# Altium schematic sheet CH592F-3MODE-MS-T0-1v2.SchDoc
size 350 x 330 mm
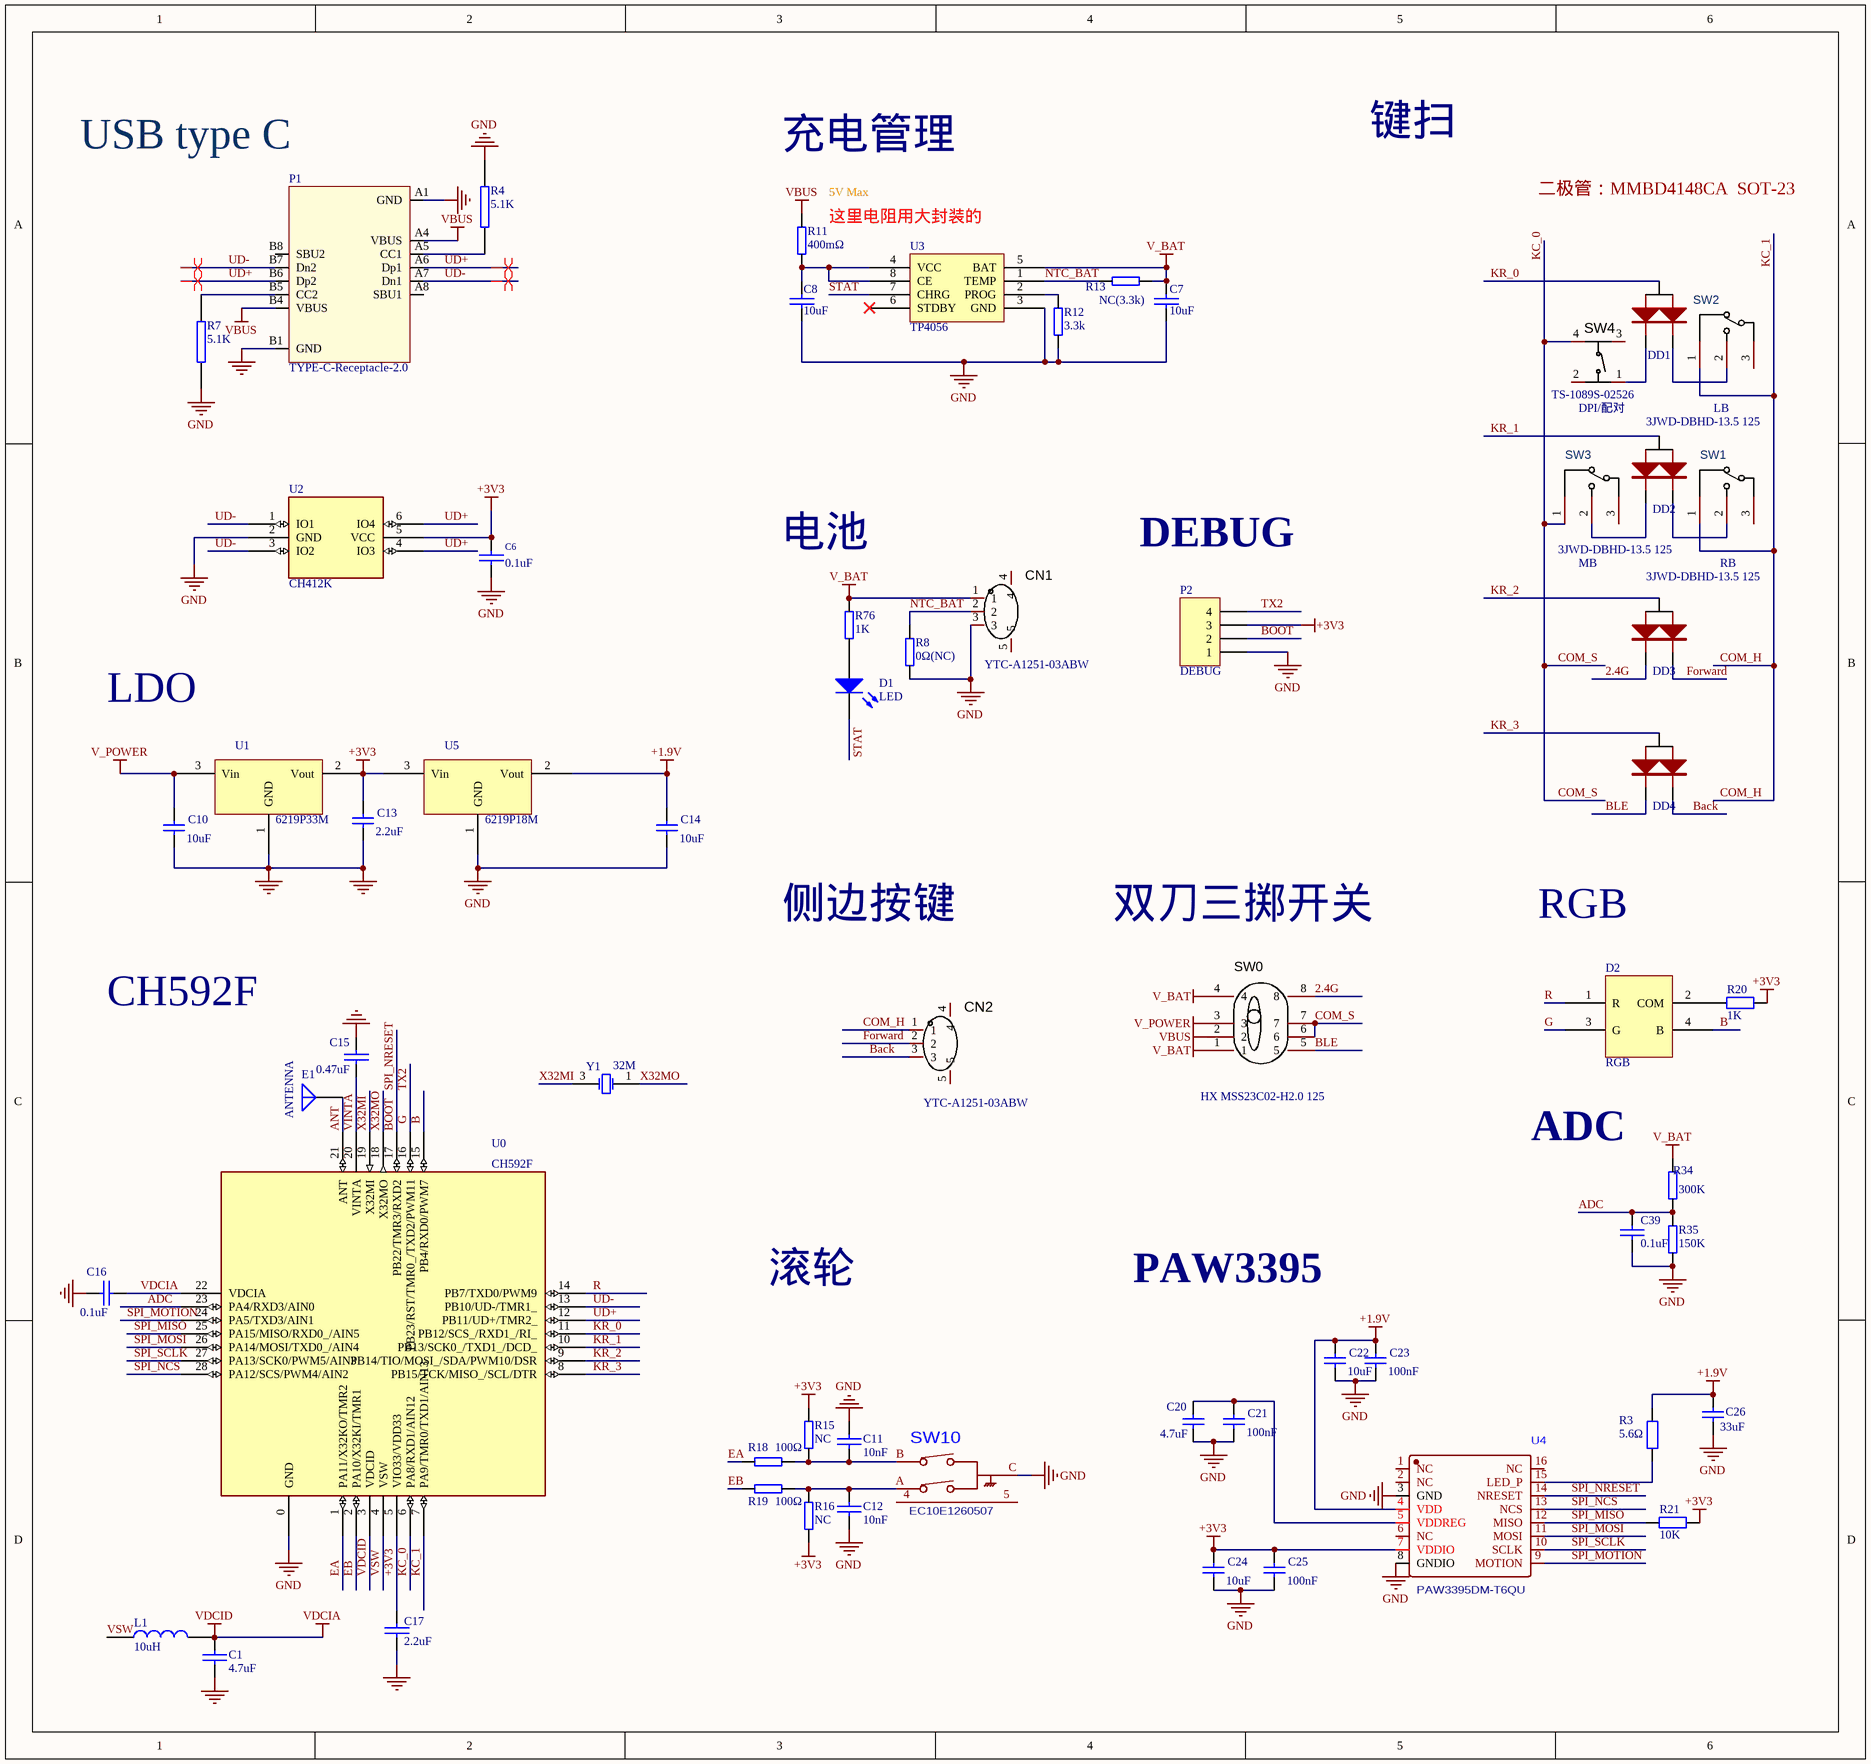
[diagram p0: CH592F-3MODE-MS-T0-1v2.SchDoc]

## Parts
C1  4.7uF  [0402_C]
C6  0.1uF  [0402_C]
C7  10uF  [0603_C]
C8  10uF  [0603_C]
C10  10uF  [0603_C]
C11  10nF  [0402_C]
C12  10nF  [0402_C]
C13  2.2uF  [0402_C]
C14  10uF  [0603_C]
C15  0.47uF  [0402_C]
C16  0.1uF  [0402_C]
C17  2.2uF  [0402_C]
C20  4.7uF  [0402_C]
C21  100nF  [0402_C]
C22  10uF  [0603_C]
C23  100nF  [0402_C]
C24  10uF  [0603_C]
C25  100nF  [0402_C]
C26  33uF  [3528_C]
C39  0.1uF  [0402_C]
CN1  YTC-A1251-03ABW  [CONN-SMD_3P-P1.25_YTC-A1251-03ABW]
CN2  YTC-A1251-03ABW  [CONN-SMD_3P-P1.25_YTC-A1251-03ABW]
D1  LED  [0603+]
D2  RGB  [RGB]
DD1  DIODE  [SOT-23]  (value not drawn)
DD2  DIODE  [SOT-23]  (value not drawn)
DD3  DIODE  [SOT-23]  (value not drawn)
DD4  DIODE  [SOT-23]  (value not drawn)
E1  ANTENNA  [ANT-F-1-2.4G-1.0mmFR4]
L1  10uH  [SMD_2x2mm]
P1  TYPE-C-Receptacle-2.0  [TYPE-C-Receptacle-2.0-6.5*8.94*3.16-SinkDown]
P2  DEBUG  [SIP4-2.54mm]
R3  5.6Ω  [0402]
R4  5.1K  [0402]
R7  5.1K  [0402]
R8  0Ω(NC)  [0402]
R11  400mΩ  [1206]
R12  3.3k  [0402]
R13  NC(3.3k)  [0402]
R15  NC  [0402]
R16  NC  [0402]
R18  100Ω  [0402]
R19  100Ω  [0402]
R20  1K  [0402]
R21  10K  [0402]
R34  300K  [0402]
R35  150K  [0402]
R76  1K  [0402]
SW0  HX MSS23C02-H2.0 125  [SW-SMD_HX-MSS23C02-H2.0-125]
SW1  3JWD-DBHD-13.5 125  [SW-TH_SHOU-HAN_3JWD-DBHD-13.5]
SW2  3JWD-DBHD-13.5 125  [SW-TH_SHOU-HAN_3JWD-DBHD-13.5]
SW3  3JWD-DBHD-13.5 125  [SW-TH_SHOU-HAN_3JWD-DBHD-13.5]
SW4  TS-1089S-02526  [SW-SMD_4P-L4.2-W3.3-P2.15-LS5.1]
SW10  EC10E1260507  [SW-TH_EC10EXXXXXXX]
U0  CH592F  [QFN28_4X4]
U1  6219P33M  [SOT-23]
U2  CH412K  [SOT-363]
U3  TP4056  [ESOP8]
U4  PAW3395DM-T6QU  [DIP-16_PAW3395DM-T6QU]
U5  6219P18M  [SOT-23]
Y1  32M  [XT3225]

## Nets
+1.9V: C14.1 C22.1 C23.1 C26.1 R3.1 U4.4(VDD) U5.2(Vout)
+3V3: C6.2 C13.1 C17.2 C24.1 C25.1 P2.3 R15.2 R16.1 R20.1 R21.1 U0.5(VIO33/VDD33) U1.2(Vout) U2.5(VCC) U4.7(VDDIO) U5.3(Vin)
GND: C1.1 C6.1 C7.2 C8.2 C10.2 C11.1 C12.1 C13.2 C14.2 C15.2 C16.2 C17.1 C20.2 C21.2 C22.2 C23.2 C24.2 C25.2 C26.2 C39.2 CN1.3 P1.A1(GND) P1.B1(GND) P2.1 R4.2 R7.1 R8.2 R12.2 R35.1 SW10.C U0.0(GND) U1.1(GND) U2.2(GND) U3.3(GND) U4.3(GND) U4.8(GNDIO) U5.1(GND)
V_BAT: C7.1 CN1.1 R13.1 R34.2 R76.2 SW0.1 SW0.4 U3.5(BAT)
V_POWER: C10.1 SW0.3 U1.3(Vin)
VBUS: P1.A4(VBUS) P1.B4(VBUS) R11.1 SW0.2
VDCIA: C1.2 C16.1 L1.2 U0.3(VDCID) U0.22(VDCIA)  [also labelled VDCID]
2.4G: DD3.2 SW0.8
ADC: C39.1 R34.1 R35.2 U0.23(PA4/RXD3/AIN0)
ANT: E1.1(A) U0.21(ANT)
B: D2.4(B) U0.15(PB4/RXD0/PWM7)
Back: CN2.3 DD4.1
BLE: DD4.2 SW0.5
BOOT: P2.2 U0.17(PB22/TMR3/RXD2) U4.14(NRESET)  [also labelled SPI_NRESET]
COM_H: CN2.1 SW1.1(C) SW2.1(C) U0.7(PA9/TMR0/TXD1/AIN13)  [also labelled KC_1]
COM_S: SW0.6 SW0.7 SW3.1(C) SW4.4 U0.6(PA8/RXD1/AIN12)  [also labelled KC_0]
EA: R18.2 U0.1(PA11/X32KO/TMR2)
EB: R19.1 U0.2(PA10/X32KI/TMR1)
Forward: CN2.2 DD3.1
G: D2.3(G) P2.4 U0.16(PB23/RST/TMR0_/TXD2/PWM11)  [also labelled TX2]
KR_0: DD1.3 U0.11(PB12/SCS_/RXD1_/RI_)
KR_1: DD2.3 U0.10(PB13/SCK0_/TXD1_/DCD_)
KR_2: DD3.3 U0.9(PB14/TIO/MOSI_/SDA/PWM10/DSR)
KR_3: DD4.3 U0.8(PB15/TCK/MISO_/SCL/DTR)
NTC_BAT: CN1.2 R8.1 R13.2 U3.1(TEMP)
R: D2.1(R) U0.14(PB7/TXD0/PWM9)
SPI_MISO: R21.2 U0.25(PA15/MISO/RXD0_/AIN5) U4.12(MISO)
SPI_MOSI: U0.26(PA14/MOSI/TXD0_/AIN4) U4.11(MOSI)
SPI_MOTION: U0.24(PA5/TXD3/AIN1) U4.9(MOTION)
SPI_NCS: U0.28(PA12/SCS/PWM4/AIN2) U4.13(NCS)
SPI_SCLK: U0.27(PA13/SCK0/PWM5/AIN3) U4.10(SCLK)
STAT: D1.2(K) U3.7(CHRG)
UD+: P1.A6(Dp1) P1.B6(Dp2) U0.12(PB11/UD+/TMR2_) U2.4(IO3) U2.6(IO4)
UD-: P1.A7(Dn1) P1.B7(Dn2) U0.13(PB10/UD-/TMR1_) U2.1(IO1) U2.3(IO2)
VINTA: C15.1 U0.20(VINTA)
VSW: L1.1 U0.4(VSW)
X32MI: U0.19(X32MI) Y1.3(OSC2)
X32MO: U0.18(X32MO) Y1.1(OSC1)
NetC8_1: C8.1 R11.2 U3.4(VCC) U3.8(CE)
NetC11_2: C11.2 R15.1 R18.1 SW10.B
NetC12_2: C12.2 R16.2 R19.2 SW10.A
NetC20_1: C20.1 C21.1 U4.5(VDDREG)
NetD1_1: D1.1(A) R76.1
NetD2_2: D2.2(COM) R20.2
NetDD1_1: DD1.1 SW2.2(ON)
NetDD1_2: DD1.2 SW4.1
NetDD2_1: DD2.1 SW1.2(ON)
NetDD2_2: DD2.2 SW3.2(ON)
NetP1_A5: P1.A5(CC1) R4.1
NetP1_B5: P1.B5(CC2) R7.2
NetR3_2: R3.2 U4.15(LED_P)
NetR12_1: R12.1 U3.2(PROG)

Not connected (* = marked no-connect by the designer): CN1 4 5; CN2 4 5; P1 A8(SBU1) B8(SBU2); SW1 3(NC); SW2 3(NC); SW3 3(NC); SW4 2 3; SW10 4 5; U3 6(STDBY)*; U4 1(NC) 2(NC) 6(NC) 16(NC)

## Layout directives
differential pair: UD+, UD-

## Notes on the sheet
- (near P1) USB type C
- 充电管理
- 键扫
- (near R11) 5V Max
- 这里电阻用大封装的
- 二极管：MMBD4148CA  SOT-23
- (near SW4) DPI/配对
- LB
- 电池
- DEBUG
- MB
- RB
- LDO
- 侧边按键
- 双刀三掷开关
- RGB
- CH592F
- ADC
- 滚轮
- PAW3395

## Library data of the parts
C1 C6-C8 C11 C12 C15-C17 C39 = CAP: Capacitor
C10 C13 C14 C20-C26 = Cap: Capacitor; Published: 8-Jun-2000; LatestRevisionDate: 17-Jul-2002; LatestRevisionNote: Re-released for DXP Platform.; PackageReference: RAD-0.3; Publisher: Altium Limited; PackageDescription: Radial Cap, Thru-Hole; 2 Leads; 0.3 in Pin Spacing
CN1 CN2 = YTC-A1251-03ABW: Manufacturer: YIYUAN(怡远); Add into BOM: yes; Pins Structure: 1x3P; Pitch: 1.25mm; Number of PINs Per Row: 3; Current Rating (Max): 1A; Symbol: YTC-A1251-03ABW; Device: YTC-A1251-03ABW; LCSC Part Name: 1.25mm 1x3P卧贴; Supplier Part: C7436576; Manufacturer Part: YTC-A1251-03ABW; Supplier Footprint: P=1.25mm; JLCPCB Part Class: Extended Part; Datasheet: https://atta.szlcsc.com/upload/public/pdf/source/20230703/1435987A1D1278BD8E0276EA6FE76C2F.pdf; Supplier: LCSC; Convert to PCB: yes; Mounting Style: 卧贴; Number of Pins: 3P; Number of Rows: 1; Operating Temperature Range: -25℃~+85℃
D1 = LED0: Typical INFRARED GaAs LED; Published: 8-Jun-2000; LatestRevisionDate: 08-Jul-2005; LatestRevisionNote: Mech Layer 1 removed.; PackageReference: LED-0; Publisher: Altium Limited; PackageDescription: LED; 2 Leads
D2 = RGB: 共阳
E1 = ANTENNA: Generic Antenna
L1 = INDUCTOR
P1 = TYPE-C-Receptacle-2.0: Type-C USB2.0 母座
P2 = Header 4: Header, 4-Pin; LatestRevisionDate: 17-Jul-2002; LatestRevisionNote: Re-released for DXP Platform.; Publisher: Altium Limited
R3 R20 R21 = Res2: Resistor; Published: 8-Jun-2000; LatestRevisionDate: 17-Jul-2002; LatestRevisionNote: Re-released for DXP Platform.; PackageReference: AXIAL-0.4; Publisher: Altium Limited; PackageDescription: Axial Device, Thru-Hole; 2 Leads; 0.4 in Pin Spacing
R4 R7 = RES2
R8 R11-R13 R15 R16 R18 R19 R34 R35 R76 = RES
SW0 = HX MSS23C02-H2.0 125: Manufacturer: hanxia(韩下); Add into BOM: yes; Circuit: 双刀三掷; Actuator Style: 矩形柱状; Pin Style: SMD接片; Current Rating (DC): 100mA; Voltage Rating (DC): 12V; Mechanical Life: 1万次; Symbol: HX MSS23C02-H2.0 125; Device: HX MSS23C02-H2.0 125; Supplier: LCSC; Supplier Part: C18357575; Manufacturer Part: HX MSS23C02-H2.0 125; LCSC Part Name: 小型8脚3档位 立贴拨动 柄长2.0MM; Supplier Footprint: SMD,9.9x3.5mm; Datasheet: https://atta.szlcsc.com/upload/public/pdf/source/20231016/0AB1F9BA5921398E4CF86D5ACEC95738.pdf; Convert to PCB: yes; Mounting Style: 立贴; Operating Temperature: -25℃~+70℃
SW1-SW3 = 3JWD-DBHD-13.5 125: Manufacturer: SHOU HAN(首韩); Add into BOM: yes; Circuit: 单刀双掷; Actuator Style: 脚按动; Switch Length: 12.8mm; Switch Width: 5.7mm; Switch Height: 6.6mm; Contact Current (DC): 100mA; Voltage Rating (DC): 125V; Mechanical Life: 100万次; Pin Style: PC引脚; Symbol: 3JWD-DBHD-13.5 125; Device: 3JWD-DBHD-13.5 125; Supplier: LCSC; Supplier Part: C2906291; Manufacturer Part: 3JWD-DBHD-13.5 125; JLCPCB Part Class: Extended Part; LCSC Part Name: 12.8*5.7*6.6mm 插件微动开关; Supplier Footprint: 插件; Datasheet: https://atta.szlcsc.com/upload/public/pdf/source/20211019/52ACE125E0FDD69DD4046775F52831F0.pdf; Convert to PCB: yes; Type: 微动开关; Contact Current (AC): -; Voltage Rating (AC): -; Operating Temperature: -25℃~+85℃
SW4 = TS-1089S-02526: Manufacturer: XUNPU(讯普); Add into BOM: yes; Circuit: 单刀单掷; Actuator Style: 椭圆形按钮; Switch Length: 4.2mm; Switch Width: 3.25mm; Switch Height: 2.5mm; Contact Current: 50mA; Voltage Rating (DC): 12V; Symbol: TS-1089S-02526; Device: TS-1089S-02526; Supplier: LCSC; Supplier Part: C455282; Manufacturer Part: TS-1089S-02526; JLCPCB Part Class: Extended Part; LCSC Part Name: 4.2*3.25*2.5mm 立贴 轻触开关; Supplier Footprint: SMD,3.3x4.2mm; Datasheet: https://atta.szlcsc.com/upload/public/pdf/source/20191118/C455282_2E86A26A9CC4FEF4662951C4D45ED672.pdf; Convert to PCB: yes; Mounting Style: 立贴; With Lamp: -; Mechanical Life: -
U0 = CH592F: RISC-V MCU with BLE/USB/ADC/SPI/4*UART/I2C/LCD
U2 = CH412K: Qaud ESD protect, high speed
U5 = 6219P33M
Y1 = XTAL: Crystal Oscillator; Published: 8-Jun-2000; LatestRevisionDate: 17-Jul-2002; LatestRevisionNote: Re-released for DXP Platform.; PackageReference: R38; Publisher: Altium Limited; PackageDescription: Crystal, Thru-Hole; 2 Leads; Body 3.1 x 8.2 mm (Dia.xH)